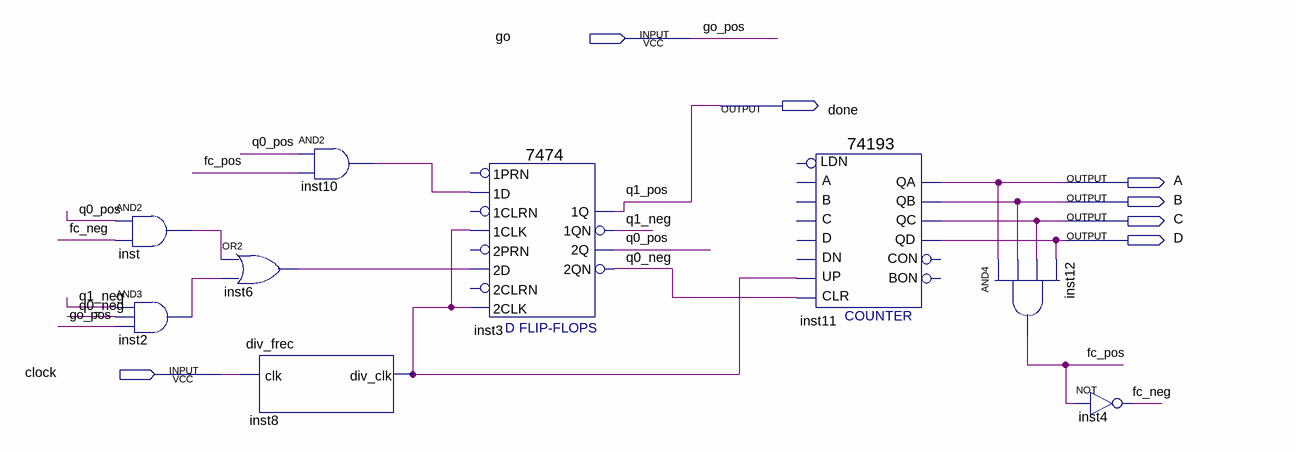
[diagram p0: schematic sheet]
// Quartus schematic practica2_1.bdf as structural Verilog: 9 symbols, 7 pins
module practica2_1 (
  input  go,
  input  clock,
  output done,
  output A,
  output B,
  output C,
  output D
);

  wire fc_neg, fc_pos, inst2_out, inst6_out, inst8_div_clk, inst10_out, inst_out, q0_neg, q0_pos, q1_neg;

  and inst (inst_out, q0_pos, fc_neg);
  and inst2 (inst2_out, q1_neg, q0_neg, go);
  or inst6 (inst6_out, inst_out, inst2_out);
  div_frec inst8 (.clk(clock), .div_clk(inst8_div_clk));
  and inst10 (inst10_out, q0_pos, fc_pos);
  \7474  inst3 (
    .\2D (inst6_out), .\1CLK (inst8_div_clk), .\1D (inst10_out), .\2CLK (inst8_div_clk), .\1QN (q1_neg),
    .\2Q (q0_pos), .\2QN (q0_neg), .\1Q (done));  // open: 2PRN, 1PRN, 2CLRN, 1CLRN
  \74193  inst11 (
    .CLR(q0_neg), .UP(inst8_div_clk), .QB(B), .QA(A), .QD(D), .QC(C));  // open: D, C, B, A, DN, LDN, CON, BON
  and inst12 (fc_pos, A, B, C, D);
  not inst4 (fc_neg, fc_pos);

  // Other names for the same wires on the sheet: q1_pos = done; go_pos = go
endmodule
